# Altium schematic sheet LEDS.SchDoc
size A4
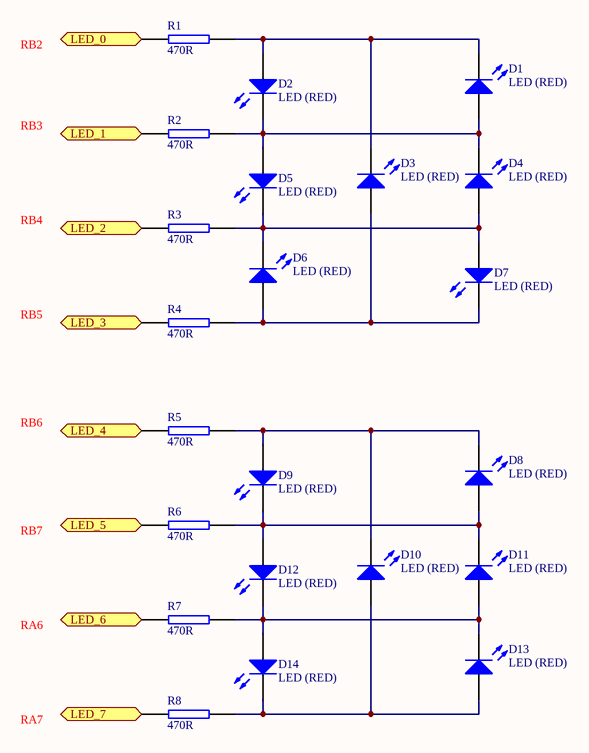
[diagram p0: LEDS.SchDoc]

## Parts
D1  LED (RED)  [PLCC_2]
D2  LED (RED)  [PLCC_2]
D3  LED (RED)  [PLCC_2]
D4  LED (RED)  [PLCC_2]
D5  LED (RED)  [PLCC_2]
D6  LED (RED)  [PLCC_2]
D7  LED (RED)  [PLCC_2]
D8  LED (RED)  [PLCC_2]
D9  LED (RED)  [PLCC_2]
D10  LED (RED)  [PLCC_2]
D11  LED (RED)  [PLCC_2]
D12  LED (RED)  [PLCC_2]
D13  LED (RED)  [PLCC_2]
D14  LED (RED)  [PLCC_2]
R1  470R  [RES (3D) - 0603]
R2  470R  [RES (3D) - 0603]
R3  470R  [RES (3D) - 0603]
R4  470R  [RES (3D) - 0603]
R5  470R  [RES (3D) - 0603]
R6  470R  [RES (3D) - 0603]
R7  470R  [RES (3D) - 0603]
R8  470R  [RES (3D) - 0603]

## Ports
LED_0 (in), LED_1 (in), LED_2 (in), LED_3 (in), LED_4 (in), LED_5 (in), LED_6 (in), LED_7 (in)

## Nets
LED_0: R1.1 ; port LED_0
LED_1: R2.1 ; port LED_1
LED_2: R3.1 ; port LED_2
LED_3: R4.1 ; port LED_3
LED_4: R5.1 ; port LED_4
LED_5: R6.1 ; port LED_5
LED_6: R7.1 ; port LED_6
LED_7: R8.1 ; port LED_7
NetD1_1: D1.1(A) D2.2(K) D4.2(K) D5.1(A) R2.2
NetD1_2: D1.2(K) D2.1(A) D3.2(K) R1.2
NetD3_1: D3.1(A) D6.1(A) D7.2(K) R4.2
NetD4_1: D4.1(A) D5.2(K) D6.2(K) D7.1(A) R3.2
NetD8_1: D8.1(A) D9.2(K) D11.2(K) D12.1(A) R6.2
NetD8_2: D8.2(K) D9.1(A) D10.2(K) R5.2
NetD10_1: D10.1(A) D13.1(A) D14.2(K) R8.2
NetD11_1: D11.1(A) D12.2(K) D13.2(K) D14.1(A) R7.2

## Notes on the sheet
- RB2
- RB3
- RB4
- RB5
- RB6
- RB7
- RA6
- RA7

## Library data of the parts
D1-D14 = LED 3mm RED: 3mm RED LED
R1-R8 = RES SMD 0603 590R: RESISTOR SMD 0603 590R; Substitute Allowed: Yes; value: 470R